# EAGLE design Genesis giraffe (EAGLE 9.1.0)
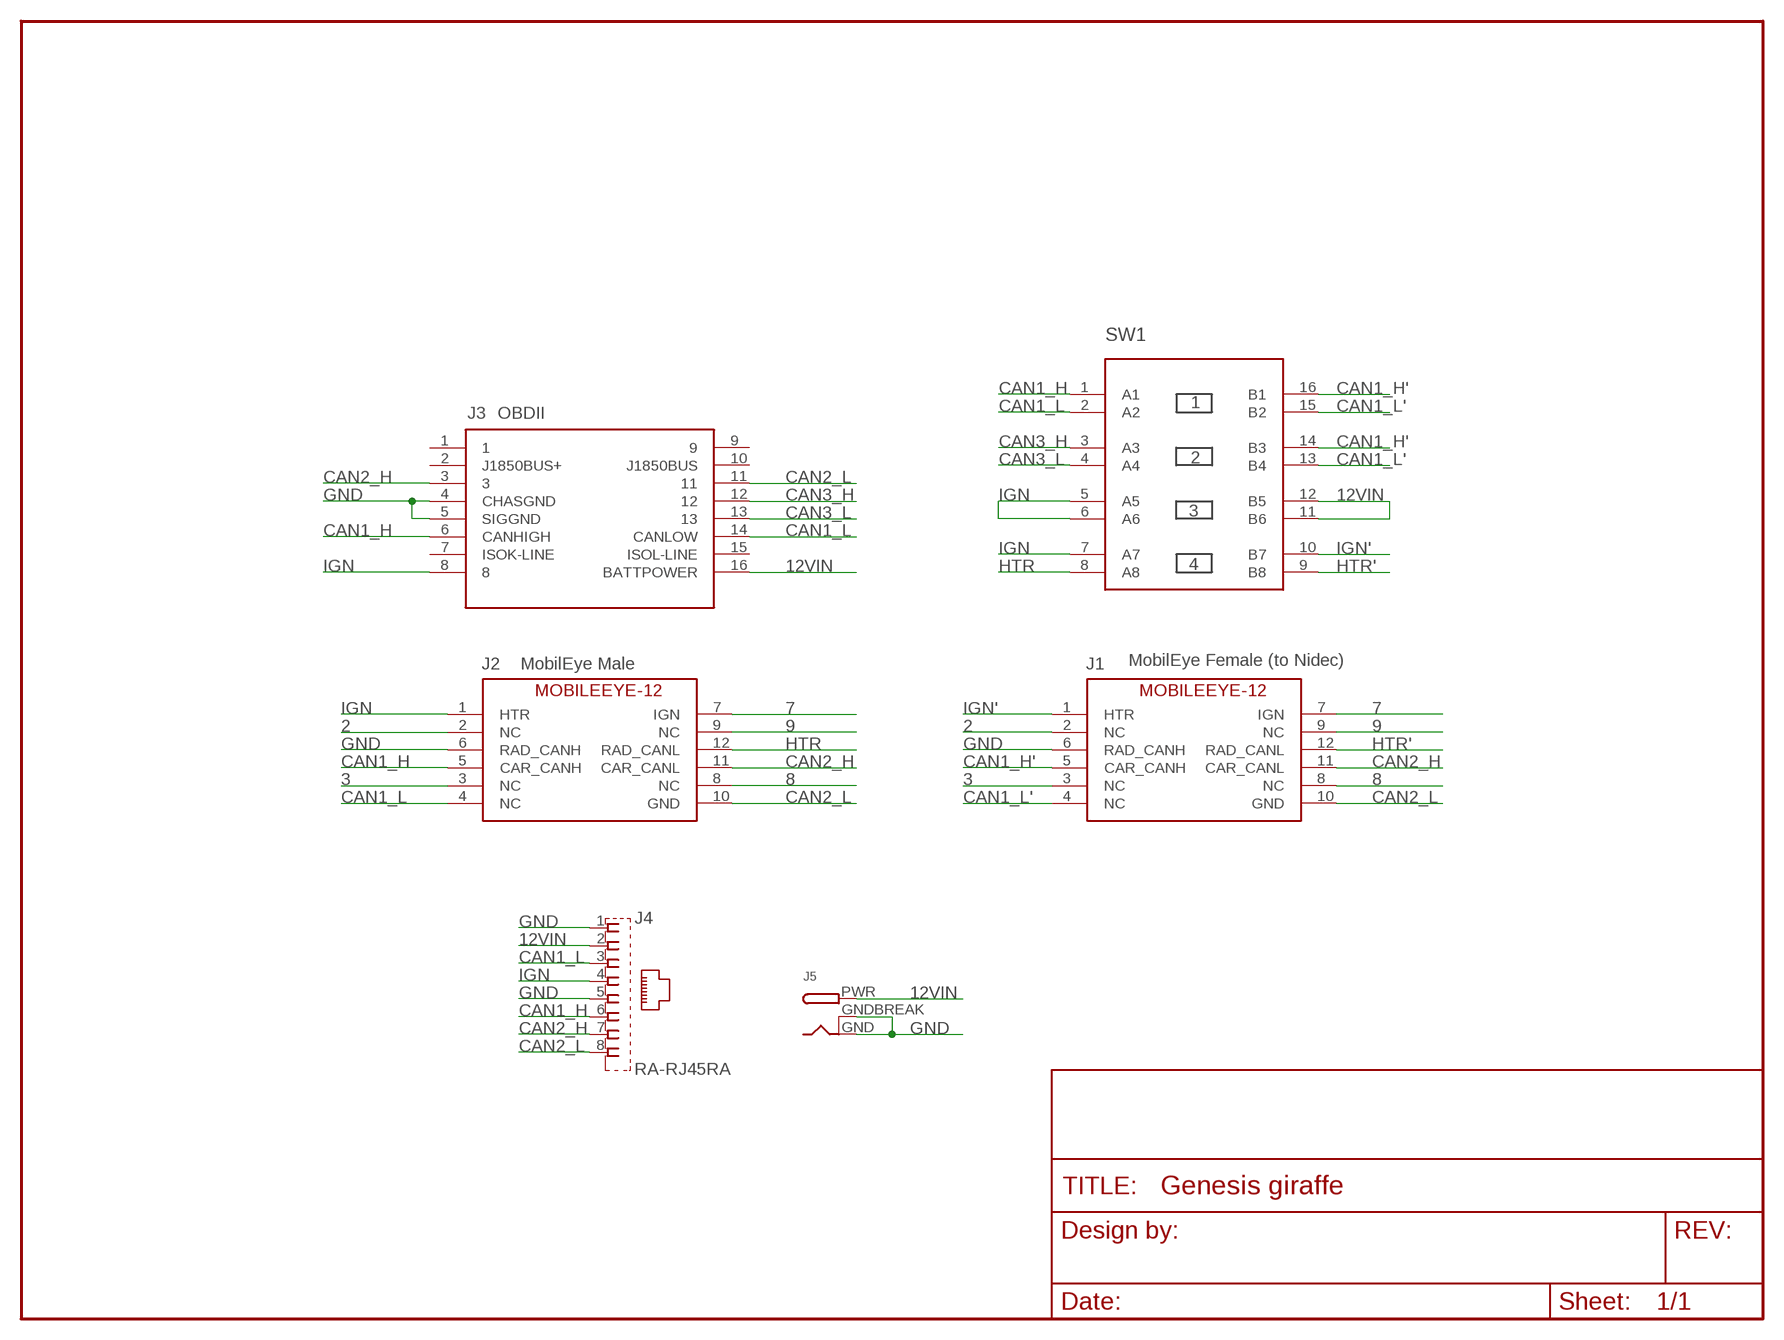
[diagram p0: schematic, sheet 1]

## Parts
FRAME1  FRAME-LETTERNO_PACKAGE  [DUMMY]
J1  MOBILEEYE-12FEMALE  [2X6-TE-FEMALE]
J2  MOBILEEYE-12MALE  [2X6-TE-RA]
J3  COMMA.AI_OBDII-FEMALE  [COMMA.AI_2X6-TE-FEMALE_NEW1]
J4  RA-RJ45RA  [RA-RJ45]
J5  DCBARRELPTH  [DCJACK_2MM_PTH]
SW1  4XDPSTSMT  [4-DPST]

## Nets
2: J1.2(NC) J2.2(NC)
3: J1.3(NC) J2.3(NC)
7: J1.7(IGN) J2.7(IGN)
8: J1.8(NC) J2.8(NC)
9: J1.9(NC) J2.9(NC)
12VIN: J3.16(BATTPOWER) J4.2 J5.PWR SW1.11(B6) SW1.12(B5)
CAN1_H: J2.5(CAR_CANH) J3.6(CANHIGH) J4.6 SW1.1(A1)
CAN1_H': J1.5(CAR_CANH) SW1.14(B3) SW1.16(B1)
CAN1_L: J2.4(NC) J3.14(CANLOW) J4.3 SW1.2(A2)
CAN1_L': J1.4(NC) SW1.13(B4) SW1.15(B2)
CAN2_H: J1.11(CAR_CANL) J2.11(CAR_CANL) J3.3 J4.7
CAN2_L: J1.10(GND) J2.10(GND) J3.11 J4.8
CAN3_H: J3.12 SW1.3(A3)
CAN3_L: J3.13 SW1.4(A4)
GND: J1.6(RAD_CANH) J2.6(RAD_CANH) J3.4(CHASGND) J3.5(SIGGND) J4.1 J4.5 J5.GND J5.GNDBREAK
HTR: J2.12(RAD_CANL) SW1.8(A8)
HTR': J1.12(RAD_CANL) SW1.9(B8)
IGN: J2.1(HTR) J3.8 J4.4 SW1.5(A5) SW1.6(A6) SW1.7(A7)
IGN': J1.1(HTR) SW1.10(B7)
Unconnected: J3.1 J3.2(J1850BUS+) J3.7(ISOK-LINE) J3.9 J3.10(J1850BUS) J3.15(ISOL-LINE)

## Notes on the sheet
- OBDII
- MobilEye Male | MobilEye Female (to Nidec)

## Library data of the parts
FRAME1 = SparkFun-Aesthetics:FRAME-LETTER: Schematic Frame Standard 8.5x11 US Letter frame; DESIGNER: Nobody; VERSION: v01
J1 J2 = comma.ai:MOBILEEYE-12
J3 = Genesis giraffe1:COMMA.AI_OBDII-FEMALE
J4 = comma.ai:RA-RJ45
J5 = adafruit:DCBARREL: 2.0mm DC Barrel Jack DCJACK_2MM_PTH - Through Hole Jack (4UConnector: 05537)
SW1 = comma.ai:4XDPST

## Board
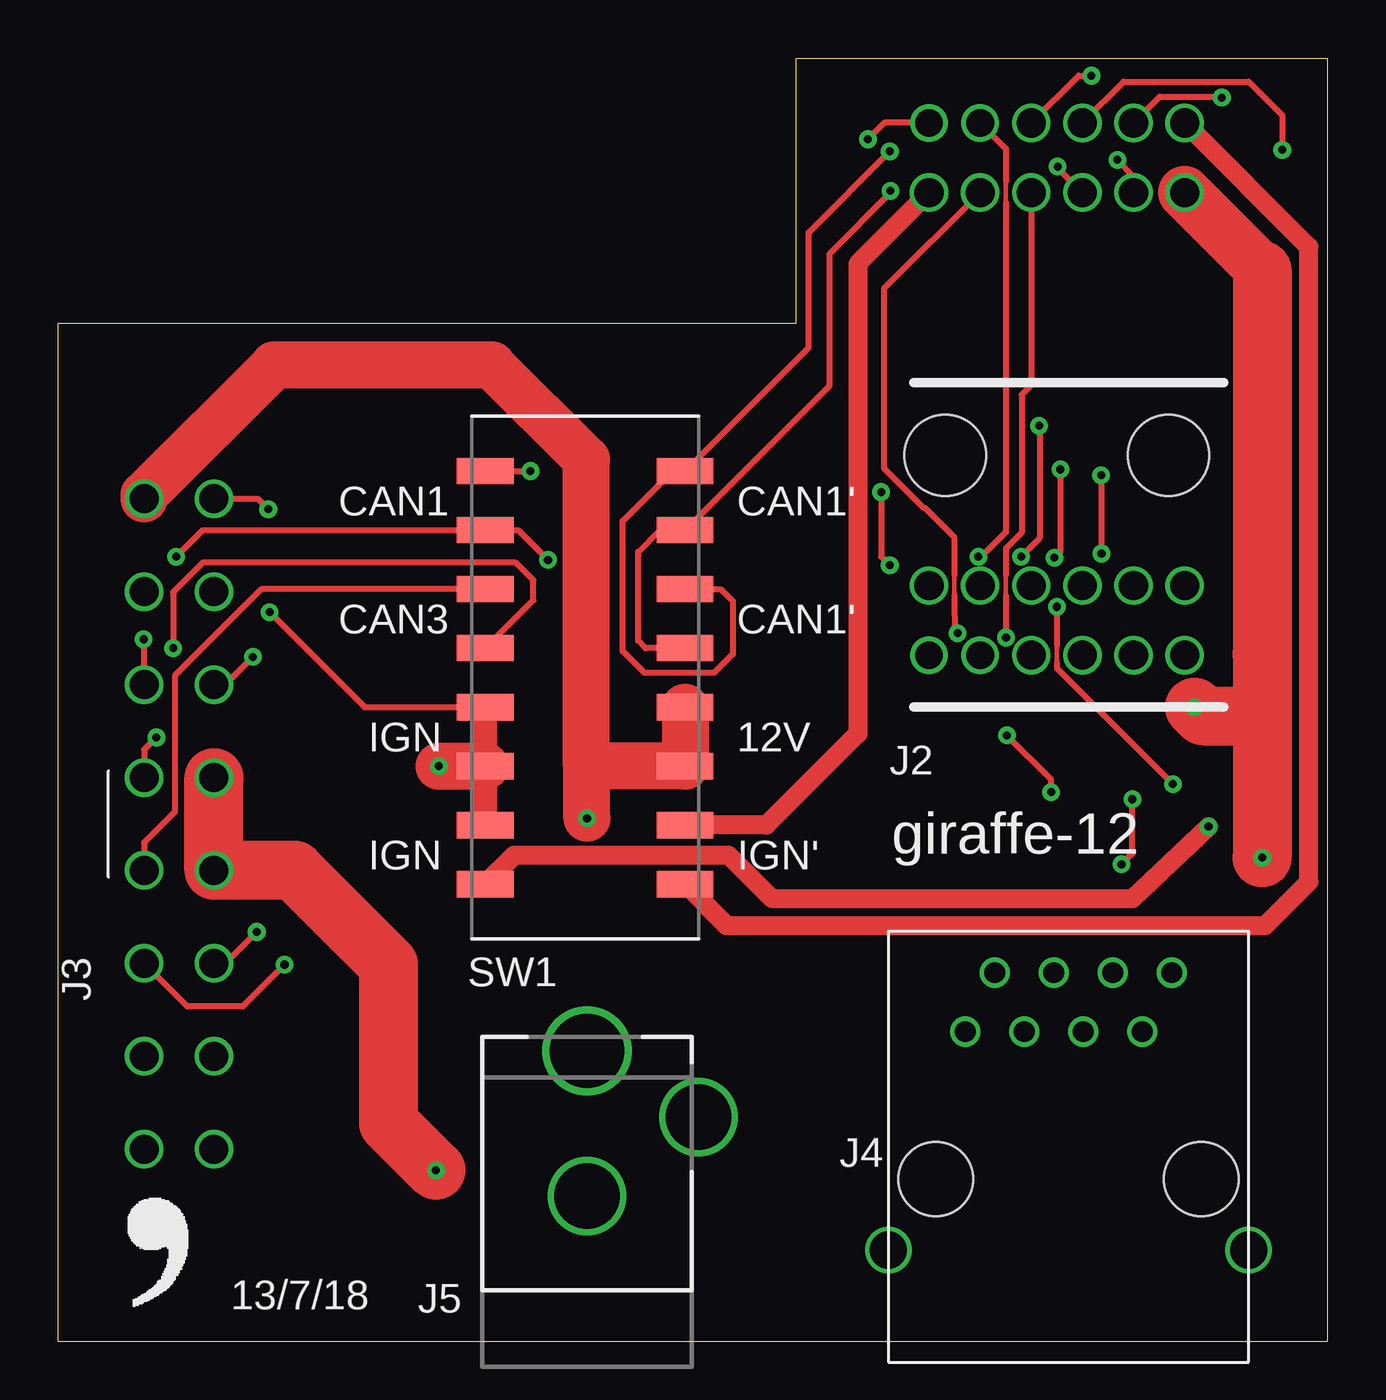
[diagram p1: board, top side]
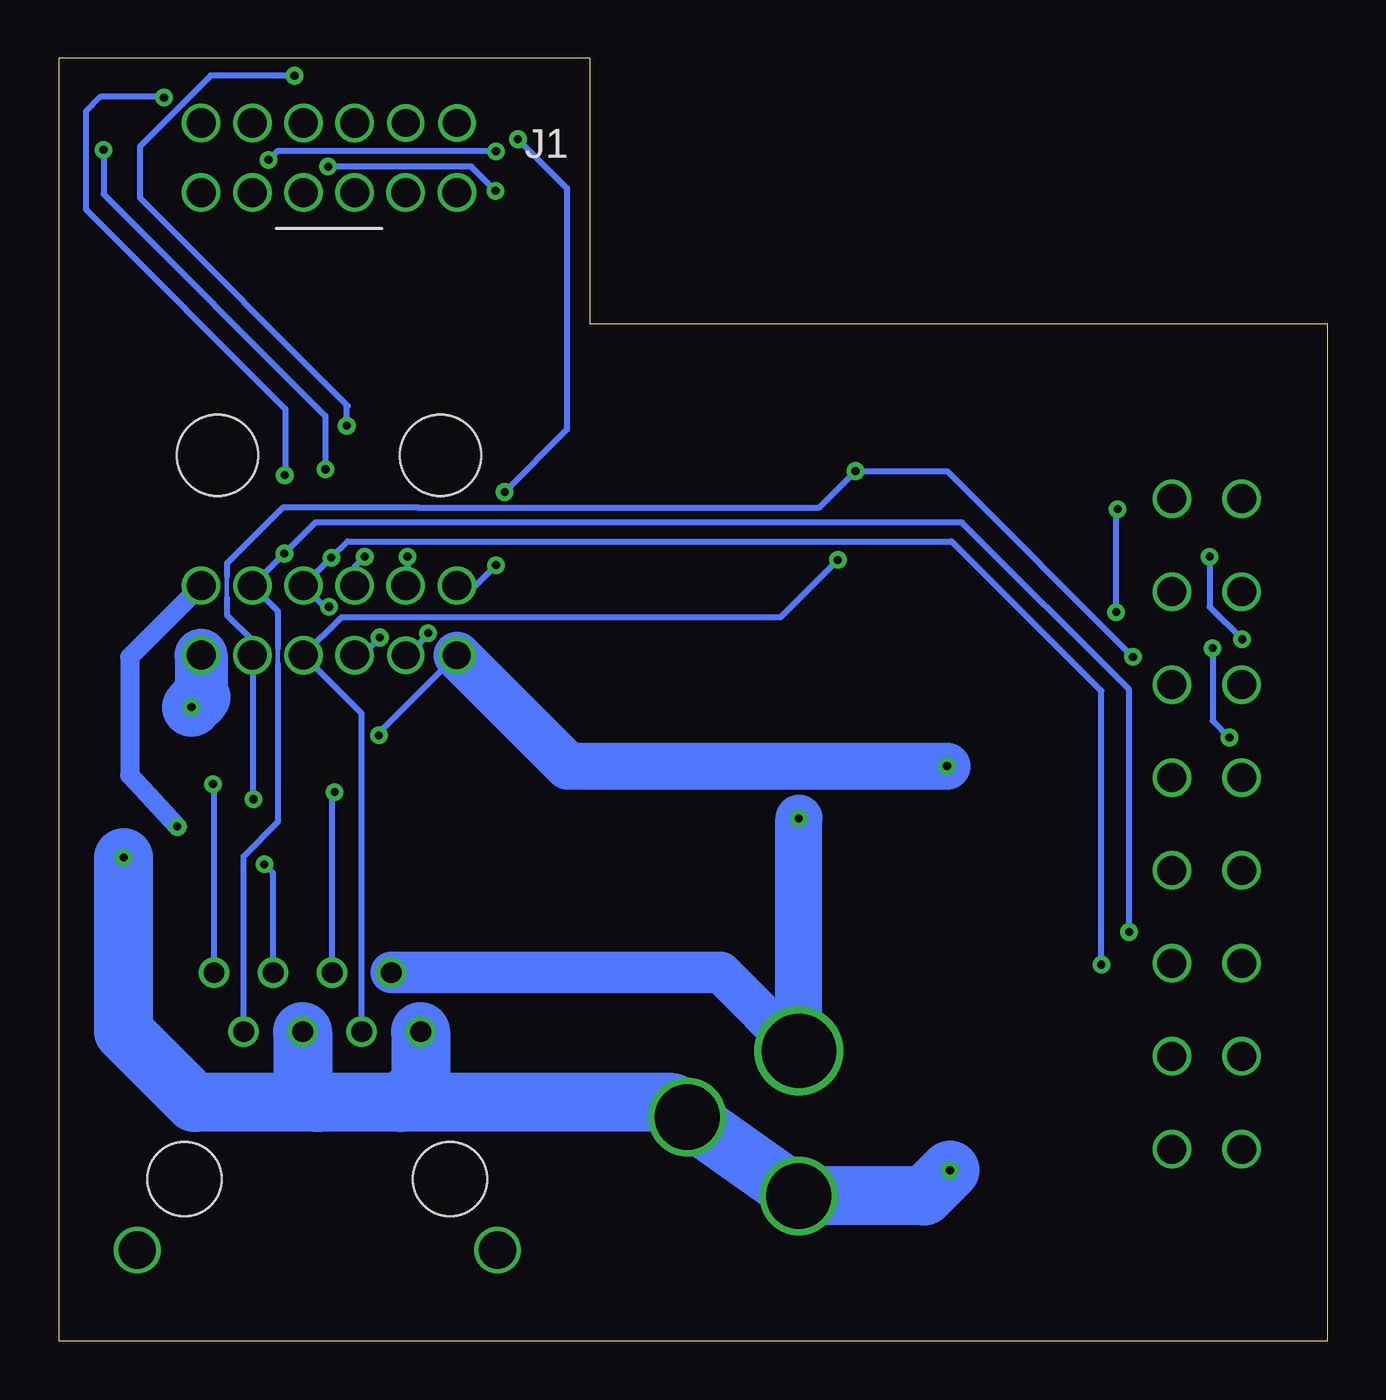
[diagram p2: board, bottom side, seen from below]

Size 54.61 x 55.24 mm. Coordinates in mm from the lower left corner, seen from the top.
Outline: 31.75,55.24 54.61,55.24 54.61,0 0,0 0,43.81 31.75,43.81 31.75,55.24
Copper layers (1*16): Top 0.035mm / dielectric 1.5mm / Bottom 0.035mm
Design rules "default *": minimum track width 6mil, minimum drill 10mil, track to track 6mil, track to pad 6mil, pad to pad 6mil, via to via 6mil, smd to smd 6mil, copper to edge 15mil, drill to drill 10mil, minimum pad ring 8mil, minimum via ring 8mil, stop-mask expansion 4mil, vias tented up to drill 0mil, thermal gap 10mil

### Footprints (pad centres in the part's own frame; a part is rotated, then mirrored left to right if it is on the bottom)
2X6-TE-FEMALE = drill 1.25: 1 -5.5,1.5; 2 -3.3,1.5; 3 -1.1,1.5; 4 1.1,1.5; 5 3.3,1.5; 6 5.5,1.5; 9 -1.1,-1.5; 10 1.1,-1.5; 11 3.3,-1.5; 12 5.5,-1.5 | drill 1.2: 7 -5.5,-1.5; 8 -3.3,-1.5
2X6-TE-RA = drill 1.2: 1 -5.5,-1.5; 2 -3.3,-1.5 | drill 1.25: 3 -1.1,-1.5; 4 1.1,-1.5; 5 3.3,-1.5; 6 5.5,-1.5; 7 -5.5,1.5; 8 -3.3,1.5; 9 -1.1,1.5; 10 1.1,1.5; 11 3.3,1.5; 12 5.5,1.5 | hole 3.5: -4.8,7.1; 4.8,7.1
COMMA.AI_2X6-TE-FEMALE_NEW1 = drill 1.25: 1 -14,-1.5; 2 -10,-1.5; 3 -6,-1.5; 4 -2,-1.5; 5 2,-1.5; 6 6,-1.5; 7 10,-1.5; 8 14,-1.5; 9 -14,1.5; 10 -10,1.5; 11 -6,1.5; 12 -2,1.5; 13 2,1.5; 14 6,1.5; 15 10,1.5; 16 14,1.5
RA-RJ45 = drill 0.9: 1 -4.445,6.35; 2 -3.175,8.89; 3 -1.905,6.35; 4 -0.635,8.89; 5 0.635,6.35; 6 1.905,8.89; 7 3.175,6.35; 8 4.445,8.89 | drill 1.6: P$1 -7.75,-3.05; P$2 7.75,-3.05 | hole 3.2: -5.715,0; 5.715,0
DCJACK_2MM_PTH = drill 2.8: GND 0,7.35; GNDBREAK 4.8,10.75 | drill 3.2: PWR 0,13.6
4-DPST = smd 1.13 x 2.44: 1 -8.89,-4.3; 2 -6.35,-4.3; 3 -3.81,-4.3; 4 -1.27,-4.3; 5 1.27,-4.3; 6 3.81,-4.3; 7 6.35,-4.3; 8 8.89,-4.3; 9 8.89,4.3; 10 6.35,4.3; 11 3.81,4.3; 12 1.27,4.3; 13 -1.27,4.3; 14 -3.81,4.3; 15 -6.35,4.3; 16 -8.89,4.3

### Placement (x,y rotation side)
FRAME1  -19.05,-10.79 0 top  (outside the outline)
J1  42.98,50.95 180 bottom
J2  42.98,31.04 0 top
J3  5.21,22.28 90 top
J4  43.48,6.99 0 top
J5  22.76,-1.09 0 top
SW1  22.68,28.57 270 top
U$1  [LOGO]  2.32,1.19 0 top

### Tracks (layer width: path | path; a pad name or v marks a point on that pad's centre or on a via)
2  (via drill 0.35)
  Top 0.203: 38.57,32.99 38.57,32.12
  Top 0.254: J1.2 35.53,45.31 35.53,37.59 37.24,35.88 37.31,35.88 38.56,34.63 38.57,32.99 | v38.71,30.49 38.58,30.37 38.57,32.12
  Bottom 0.254: v38.71,30.49 39.47,29.54 J2.2
3  (via drill 0.35)
  Top 0.203: 40.78,32.99 40.78,32.11
  Top 0.254: J1.3 41.88,41.17 41.64,40.93 41.47,40.75 41.47,34.82 40.78,34.14 40.78,32.99 | 40.78,32.11 40.78,30.32 v40.79,30.3
  Bottom 0.254: v40.79,30.3 41.56,29.54 J2.3
7  (via drill 0.35)
  Top 0.254: J1.7 35.55,52.45 v34.85,51.75 | v35.42,36.56 35.42,33.78 v35.79,33.41
  Bottom 0.254: v35.42,36.56 32.74,39.24 32.74,49.64 v34.85,51.75 | v35.79,33.41 36.66,32.54 J2.7
8  (via drill 0.35)
  Top 0.203: 40.78,49.94 40.78,49.03
  Top 0.254: J1.8 40.78,51.35 40.78,49.94 | 40.78,49.03 40.78,34.83 39.73,33.78 v39.6,33.78
  Bottom 0.254: v39.6,33.78 39.6,32.62 J2.8
9  (via drill 0.35)
  Top 0.254: J1.9 43.91,54.49 v44.46,54.49 | v41.44,33.78 42.24,34.59 42.24,39.14 42.22,39.17 v42.22,39.42
  Bottom 0.254: v44.46,54.49 48.07,54.49 51.12,51.44 51.12,49.23 42.16,40.27 42.22,40.22 v42.22,39.42 | v41.44,33.78 41.88,33.35 J2.9
12VIN  (via drill 0.35)
  Top 2.032: v22.76,22.52 22.76,24.77 | SW1.12 SW1.11 22.76,24.77 | 22.76,24.77 22.73,24.77 22.73,37.97 18.67,42.04 9.3,42.04 3.71,36.45 J3.16
  Bottom 1.778: J5.PWR 26.13,15.88 J4.2
  Bottom 2.032: J5.PWR v22.76,22.52
CAN1_H  (via drill 0.35)
  Top 0.254: SW1.1 v20.32,37.47 | v45.76,20.54 46.23,21.01 v46.23,23.34 | v8.38,29.46 7.19,28.28 J3.6
  Bottom 0.203: 47.37,32.93 47.37,32.02
  Bottom 0.254: v8.38,29.46 16.38,37.47 v20.32,37.47 21.9,35.88 39.11,35.88 39.12,35.89 44.97,35.89 47.37,33.49 47.37,32.93 | 47.37,32.02 47.37,31.28 46.28,30.19 J2.5 46.23,29.49 v46.23,23.34 | J4.6 45.39,20.16 v45.76,20.54
CAN1_H'  (via drill 0.35)
  Top 0.254: SW1.14 28.51,32.38 29.03,31.86 29.03,29.59 28.22,28.78 25.24,28.78 24.29,29.72 24.29,35.32 26.44,37.47 SW1.16 32.3,42.78 32.3,47.74 v35.79,51.23 | v45.58,50.86 46.28,50.17 J1.5
  Bottom 0.254: v35.79,51.23 45.21,51.23 v45.58,50.86
CAN1_L  (via drill 0.35)
  Top 0.254: v21.08,33.64 19.8,34.92 SW1.2 7.87,34.91 6.21,34.91 v5.08,33.78 | v3.68,30.23 3.68,28.3 J3.14
  Bottom 0.254: v21.08,33.64 23.56,31.17 42.45,31.17 J2.4 41.58,27.04 J4.3 | v5.08,33.78 5.08,31.62 v3.68,30.23
CAN1_L'  (via drill 0.35)
  Top 0.254: SW1.13 25.27,29.84 24.96,30.16 24.96,33.98 25.89,34.92 SW1.15 33.2,41.14 33.2,46.83 35.81,49.44 v35.81,49.53 | v43.02,50.57 43.02,50.51 J1.4
  Bottom 0.254: v35.81,49.53 36.86,50.57 v43.02,50.57
CAN2_H  (via drill 0.35)
  Top 0.254: J1.11 47.41,53.58 50.04,53.58 v50.08,53.55 | v44.88,37.29 44.88,33.93 v44.9,33.91 | v8.55,17.63 7.2,16.28 J3.3
  Bottom 0.203: 45.17,29.84 45.17,29.16
  Bottom 0.254: v8.55,17.63 8.55,28.05 15.75,35.26 43.56,35.26 v44.9,33.91 J2.11 45.17,31.44 45.17,29.84 | J4.7 46.66,20.88 45.17,22.36 45.17,29.16 | 44.86,40.08 44.86,40.15 53.44,48.73 53.44,52.95 52.82,53.57 50.1,53.57 v50.08,53.55 | 44.86,40.08 | 44.86,40.08 44.86,37.31 v44.88,37.29
CAN2_L  (via drill 0.35)
  Top 0.203: 42.98,29.96 42.98,29.18
  Top 0.254: v47.97,23.99 42.98,28.98 42.98,29.18 | v42.98,31.62 42.98,29.96 | J1.10 45.85,54.23 51.23,54.23 52.68,52.78 v52.68,51.3 | v43.13,37.54 43.13,34 v42.87,33.74 | v9.74,16.22 7.94,14.41 5.57,14.41 J3.11
  Bottom 0.254: v9.74,16.22 9.74,28 16.18,34.44 42.17,34.44 v42.87,33.74 J2.10 43.16,31.62 v42.98,31.62 | J4.8 47.92,23.95 v47.97,23.99 | v43.13,37.54 43.13,39.84 52.68,49.39 v52.68,51.3 | v9.74,16.22
CAN3_H
  Top 0.254: SW1.3 8.75,32.38 5.03,28.66 5.03,22.8 3.71,21.47 J3.12
CAN3_L  (via drill 0.35)
  Top 0.254: v4.23,26 3.71,25.48 J3.13 | SW1.4 20.45,31.91 20.45,32.77 19.68,33.53 6.22,33.53 4.95,32.26 v4.95,29.84
  Bottom 0.254: v4.95,29.84 4.95,26.72 v4.23,26
GND  (via drill 0.35)
  Top 2.286: J1.6 51.82,46.11
  Top 2.54: v16.26,7.37 14.22,9.4 14.22,16.22 10.17,20.28 J3.4 J3.5 | 51.82,46.11 51.82,29.59 51.82,26.92 | 51.82,26.92 v51.82,20.83 | v48.89,27.3 49.28,26.92 51.82,26.92
  Bottom 2.286: J2.6 48.48,27.72
  Bottom 2.54: v16.26,7.37 17.36,6.26 J5.GND J5.GNDBREAK 28.19,10.29 39.88,10.29 | 39.88,10.29 43.43,10.29 | 43.43,10.29 48.77,10.29 51.82,13.34 v51.82,20.83 | J4.1 39.03,11.13 39.24,10.92 39.88,10.29 | J4.5 44.11,10.97 44.07,10.92 43.43,10.29 | 48.48,27.72 v48.89,27.3
HTR  (via drill 0.35)
  Top 0.813: SW1.8 19.63,20.93 28.85,20.93 30.73,19.05 46.23,19.05 v49.5,22.16
  Bottom 0.813: v49.5,22.16 51.56,24.38 51.56,29.45 J2.12
HTR'
  Top 0.813: SW1.9 28.76,17.91 51.94,17.91 53.82,19.79 53.82,47.11 J1.12
IGN  (via drill 0.35)
  Top 0.254: v40.83,26.09 42.73,24.18 v42.73,23.65 | v9.11,31.39 13.2,27.3 SW1.5 | J3.8 8.59,36.28 v9.04,35.83
  Top 1.016: SW1.7 SW1.6 SW1.5
  Top 2.032: v16.38,24.77 SW1.6
  Bottom 0.152: 9.11,35.76 v9.04,35.83
  Bottom 0.254: J4.4 42.84,23.54 v42.73,23.65 | J2.1 40.83,26.19 v40.83,26.09 | v9.11,31.39 9.11,35.76
  Bottom 2.032: J2.1 32.7,24.77 v16.38,24.77
IGN'
  Top 0.813: J1.1 34.42,46.39 34.42,26.16 30.48,22.23 SW1.10

### Text on the board
tPlace: CAN1 | CAN1' | CAN3 | CAN1' | IGN | 12V | giraffe-12 | IGN | IGN' | 13/7/18